# Altium project Power Driver.PrjPcb
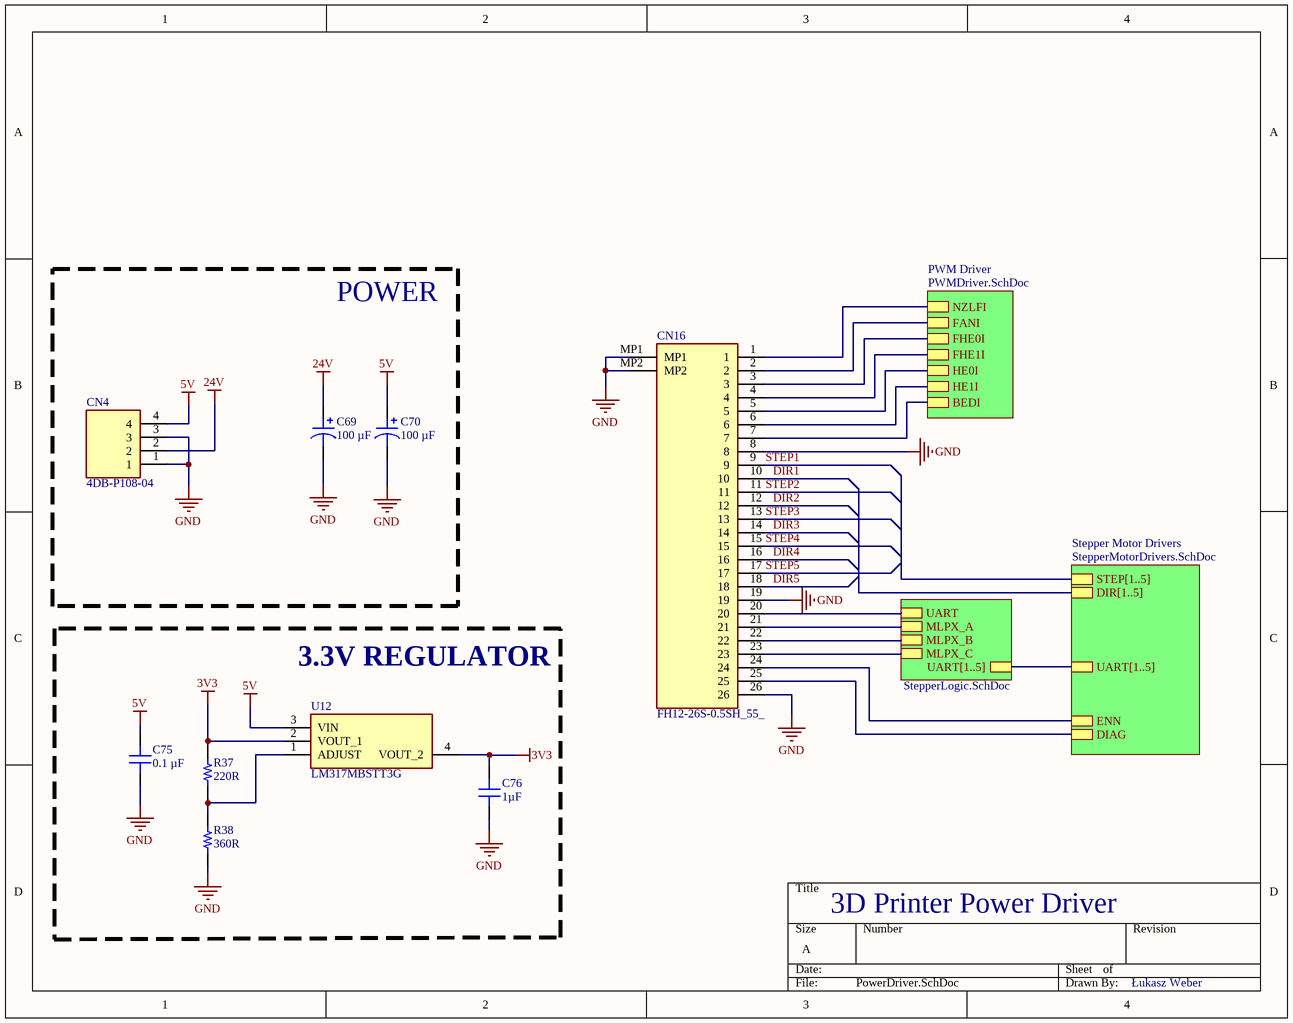
[diagram p0: PowerDriver.SchDoc]
4 sheets, 147 parts. Net scope: hierarchical (ports join the sheet entries above them; power ports are global).
Board file: PCB1.PcbDoc
Sheets:
  PowerDriver.SchDoc
    Stepper Motor Drivers = StepperMotorDrivers.SchDoc
    PWM Driver = PWMDriver.SchDoc
    Stepper Logic = StepperLogic.SchDoc

## Sheet PowerDriver.SchDoc: 3D Printer Power Driver
size A; Author: Łukasz Weber

### Parts
C69  100 µF  [CAP ALSMD 6.6MM H7.7MM]
C70  100 µF  [CAP ALSMD 6.6MM H7.7MM]
C75  0.1 µF  [CAP 0603_1608]
C76  1µF  [CAP 0603_1608]
CN4  4DB-P108-04  [SHDR4W132P0X826_1X4_3467X1270X1346P]
CN16  FH12-26S-0.5SH_55_  [FH1226S05SH55]
R37  220R  [RES 0603_1608]
R38  360R  [RES 0603_1608]
U12  LM317MBSTT3G  [SOT230P700X175-4N]

### Blocks framed on the sheet
POWER: C69 C70 CN4
3.3V REGULATOR: C75 C76 R37 R38 U12

### Sub-sheets
PWM Driver = PWMDriver.SchDoc: FHE1I, HE0I, BEDI, FANI, NZLFI, FHE0I, HE1I
Stepper Logic = StepperLogic.SchDoc: UART, MLPX_C, MLPX_A, MLPX_B, UART[1..5]
Stepper Motor Drivers = StepperMotorDrivers.SchDoc: STEP[1..5], DIAG, UART[1..5], DIR[1..5], ENN

### Nets
3V3: C76.2 R37.2 U12.2(VOUT_1) U12.4(VOUT_2)
5V: C70.1 C75.2 CN4.4 U12.3(VIN)
24V: C69.1 CN4.2
GND: C69.2 C70.2 C75.1 C76.1 CN4.1 CN4.3 CN16.8 CN16.19 CN16.26 CN16.MP1 CN16.MP2 R38.1
DIAG: CN16.25 ; sheet Stepper Motor Drivers/DIAG
DIR1: CN16.10
DIR2: CN16.12
DIR3: CN16.14
DIR4: CN16.16
DIR5: CN16.18
ENN: CN16.24 ; sheet Stepper Motor Drivers/ENN
MLPX_A: CN16.21 ; sheet Stepper Logic/MLPX_A
MLPX_B: CN16.22 ; sheet Stepper Logic/MLPX_B
MLPX_C: CN16.23 ; sheet Stepper Logic/MLPX_C
STEP1: CN16.9
STEP2: CN16.11
STEP3: CN16.13
STEP4: CN16.15
STEP5: CN16.17
UART: CN16.20 ; sheet Stepper Logic/UART
NetCN16_1: CN16.1 ; sheet PWM Driver/NZLFI
NetCN16_2: CN16.2 ; sheet PWM Driver/FANI
NetCN16_3: CN16.3 ; sheet PWM Driver/FHE0I
NetCN16_4: CN16.4 ; sheet PWM Driver/FHE1I
NetCN16_5: CN16.5 ; sheet PWM Driver/HE0I
NetCN16_6: CN16.6 ; sheet PWM Driver/HE1I
NetCN16_7: CN16.7 ; sheet PWM Driver/BEDI
NetR37_1: R37.1 R38.2 U12.1(ADJUST)

### Buses and harness runs
bus sheet Stepper Logic/UART[1..5] = sheet Stepper Motor Drivers/UART[1..5]

### Notes on the sheet
- 3D Printer Power Driver
- Łukasz Weber

### Library data of the parts
C69 C70 = UWT1E101MCL1GS: CAP ALUM 100UF 20% 25V SMD; manufacturer: Nichicon; Lifetime @ Temp.: 1000 Hrs @ 105°C; Polarization: Polar; Ripple Current @ High Frequency: 136.5 mA @ 10 kHz; Ripple Current @ Low Frequency: 91 mA @ 120 Hz; Surface Mount Land Size: 0.260" L x 0.260" W (6.60mm x 6.60mm); Part Number: UWT1E101MCL1GS; Applications: General Purpose; Capacitance: 100 µF; componentlink1description: Datasheet; componentlink1url: https://products.nichicon.co.jp/en/pdf/XJA043/e-uwt.pdf; componentlink2description: DigiKey Link; componentlink2url: https://www.digikey.com/en/products/detail/nichicon/UWT1E101MCL1GS/589931; Device Package: Radial, Can - SMD; Height - Seated (Max): 0.303" (7.70mm); lastupdated: 6/18/2023 8:45:36 PM; Lifecycle Status: Active; Minimum Order: 1; Mounting Type: Surface Mount; Operating Temperature: -55°C ~ 105°C; Package / Case: Radial, Can - SMD; packaging: TapeAndReel; partid: 27222; Part Status: Active; price: 0.10; series: UWT; Size / Dimension: 0.248" Dia (6.30mm); Supplier 1: DigiKey; Supplier Part Number 1: 493-2190-1-ND; Tolerance: ±20%; value: 100 µF; Voltage - Rated: 25 V
C75 = 0603B104K101CT: CAP CER 0.1UF 100V X7R 0603; manufacturer: Walsin Technology Corporation; Tolerance: ±10%; Part Number: 0603B104K101CT; Value: 0.1 µF; Applications: General Purpose; Capacitance: 0.1 µF; componentlink1description: Datasheet; componentlink1url: http://www.passivecomponent.com/wp-content/uploads/2018/10/MLCC.pdf; componentlink2description: DigiKey Link; componentlink2url: https://www.digikey.com/en/products/detail/walsin-technology-corporation/0603B104K101CT/9354889; Device Package: 0603 (1608 Metric); lastupdated: 4/8/2023 7:09:18 PM; Lifecycle Status: Active; Minimum Order: 1; Mounting Type: Surface Mount, MLCC; Operating Temperature: -55°C ~ 125°C; Package / Case: 0603 (1608 Metric); packaging: TapeAndReel; partid: 4273; Part Status: Active; price: 0.01; series: -; Size / Dimension: 0.063" L x 0.031" W (1.60mm x 0.80mm); Supplier 1: DigiKey; Supplier Part Number 1: 1292-1392-1-ND; Temperature Coefficient: X7R; Thickness (Max): 0.037" (0.95mm); Voltage - Rated: 100V
C76 = 0603YD105KAT4A: CAP CER 1UF 16V X5R 0603; manufacturer: AVX Corporation; Tolerance: ±10%; Part Number: 0603YD105KAT4A; Value: 1µF; Applications: General Purpose; Capacitance: 1µF; componentlink1description: Datasheet; componentlink1url: http://datasheets.avx.com/cx5r.pdf; componentlink2description: DigiKey Link; componentlink2url: http://digikey.com/product-detail/en/avx-corporation/0603YD105KAT4A/478-10365-1-ND/6797443; Device Package: 0603 (1608 Metric); lastupdated: 9/2/2020 1:03:10 AM; Lifecycle Status: Active; Minimum Order: 1; Mounting Type: Surface Mount, MLCC; Operating Temperature: -55°C ~ 85°C; Package / Case: 0603 (1608 Metric); packaging: TapeAndReel; partid: 15257; Part Status: Active; price: 0.03; series: -; Size / Dimension: 0.063" L x 0.032" W (1.60mm x 0.81mm); Supplier 1: DigiKey; Supplier Part Number 1: 478-10365-1-ND; Temperature Coefficient: X5R; Thickness (Max): 0.035" (0.90mm); Voltage - Rated: 16V
CN4 = 4DB-P108-04: Connector; Manufacturer_Name: TE Connectivity; Datasheet Link: https://www.te.com/commerce/DocumentDelivery/DDEController?Action=srchrtrv&DocNm=2-1437667-4&DocType=Customer+Drawing&DocLang=English; Height: 13.462mm; Manufacturer_Part_Number: 4DB-P108-04; Mouser Part Number: 571-214376676; Mouser Price/Stock: https://www.mouser.co.uk/ProductDetail/TE-Connectivity/4DB-P108-04?qs=JZD3Rbs9XzlqoR88q1UQbw%3D%3D; Arrow Part Number: 4DB-P108-04; Arrow Price/Stock: https://www.arrow.com/en/products/4db-p108-04/te-connectivity?region=nac
CN16 = FH12-26S-0.5SH_55_: Connector; Manufacturer_Name: Hirose; Manufacturer_Part_Number: FH12-26S-0.5SH(55); Datasheet Link: https://datasheet.datasheetarchive.com/originals/distributors/SFDatasheet-1/sf-00023459.pdf; Height: 2.2mm; Mouser Part Number: 798-FH12-26S-0.5SH55; Mouser Price/Stock: https://www.mouser.co.uk/ProductDetail/Hirose-Connector/FH12-26S-0.5SH55?qs=Ux3WWAnHpjC%2FipJJsmJDaQ%3D%3D; Arrow Part Number: FH12-26S-0.5SH(55); Arrow Price/Stock: https://www.arrow.com/en/products/fh12-26s-0.5sh-55/hirose-electric
R37 = RCS0603240RFKEA: RES SMD 240 OHM 1% 1/4W 0603; Manufacturer: Vishay Dale; Power (Watts): 0.25W, 1/4W; Resistance: 240 Ohms; Temperature Coefficient: ±100ppm/°C; Part Number: RCS0603240RFKEA; Value: 220R; ComponentLink1Description: Datasheet; ComponentLink1URL: https://www.vishay.com/docs/20065/rcse3.pdf; ComponentLink2Description: DigiKey Link; ComponentLink2URL: https://www.digikey.com/en/products/detail/vishay-dale/RCS0603240RFKEA/5868414; Composition: Thick Film; Device Package: 0603 (1608 Metric); Features: Automotive AEC-Q200, Pulse Withstanding; Height - Seated (Max): 0.020" (0.50mm); LastUpdated: 4/8/2023 7:29:03 PM; Lifecycle Status: Active; Minimum Order: 1; Number of Terminations: 2; Operating Temperature: -55°C ~ 155°C; Package / Case: 0603 (1608 Metric); Packaging: TapeAndReel; PartId: 62490; Part Status: Active; Price: 0.02; Ratings: AEC-Q200; Series: RCS e3; Size / Dimension: 0.061" L x 0.033" W (1.55mm x 0.85mm); Supplier 1: DigiKey; Supplier Part Number 1: 541-RCS0603240RFKEACT-ND; Supplier Device Package: 0603; Tolerance: ±1%
R38 = ESR03EZPJ202: RES SMD 2K OHM 5% 1/4W 0603; Manufacturer: Rohm Semiconductor; Power (Watts): 0.25W, 1/4W; Resistance: 2 kOhms; Temperature Coefficient: ±200ppm/°C; Part Number: ESR03EZPJ202; Value: 360R; ComponentLink1Description: Datasheet; ComponentLink1URL: https://www.rohm.com/datasheet/ESR01MZPF/esr-e; ComponentLink2Description: DigiKey Link; ComponentLink2URL: https://www.digikey.com/en/products/detail/rohm-semiconductor/ESR03EZPJ202/1762725; Composition: Thick Film; Device Package: 0603 (1608 Metric); Features: Automotive AEC-Q200, Pulse Withstanding; Height - Seated (Max): 0.022" (0.55mm); LastUpdated: 4/8/2023 7:30:16 PM; Lifecycle Status: Active; Minimum Order: 1; Number of Terminations: 2; Operating Temperature: -55°C ~ 155°C; Package / Case: 0603 (1608 Metric); Packaging: TapeAndReel; PartId: 16457; Part Status: Active; Price: 0.01; Ratings: AEC-Q200; Series: ESR; Size / Dimension: 0.063" L x 0.031" W (1.60mm x 0.80mm); Supplier 1: DigiKey; Supplier Part Number 1: RHM2.0KDCT-ND; Supplier Device Package: 0603; Tolerance: ±5%
U12 = LM317MBSTT3G: Integrated Circuit; Manufacturer_Name: onsemi; Datasheet Link: http://www.farnell.com/datasheets/2058184.pdf; Height: 1.75mm; Manufacturer_Part_Number: LM317MBSTT3G; Mouser Part Number: 863-LM317MBSTT3G; Mouser Price/Stock: https://www.mouser.co.uk/ProductDetail/onsemi/LM317MBSTT3G?qs=2OtswVQKCOFxsFzIc5DGlw%3D%3D; Arrow Part Number: LM317MBSTT3G; Arrow Price/Stock: https://www.arrow.com/en/products/lm317mbstt3g/on-semiconductor?region=nac

## Sheet StepperMotorDrivers.SchDoc
size C; SPICEModelCacheXNHKODXI: <root> / <DocumentId>XNHKODXI</DocumentId> / </root>
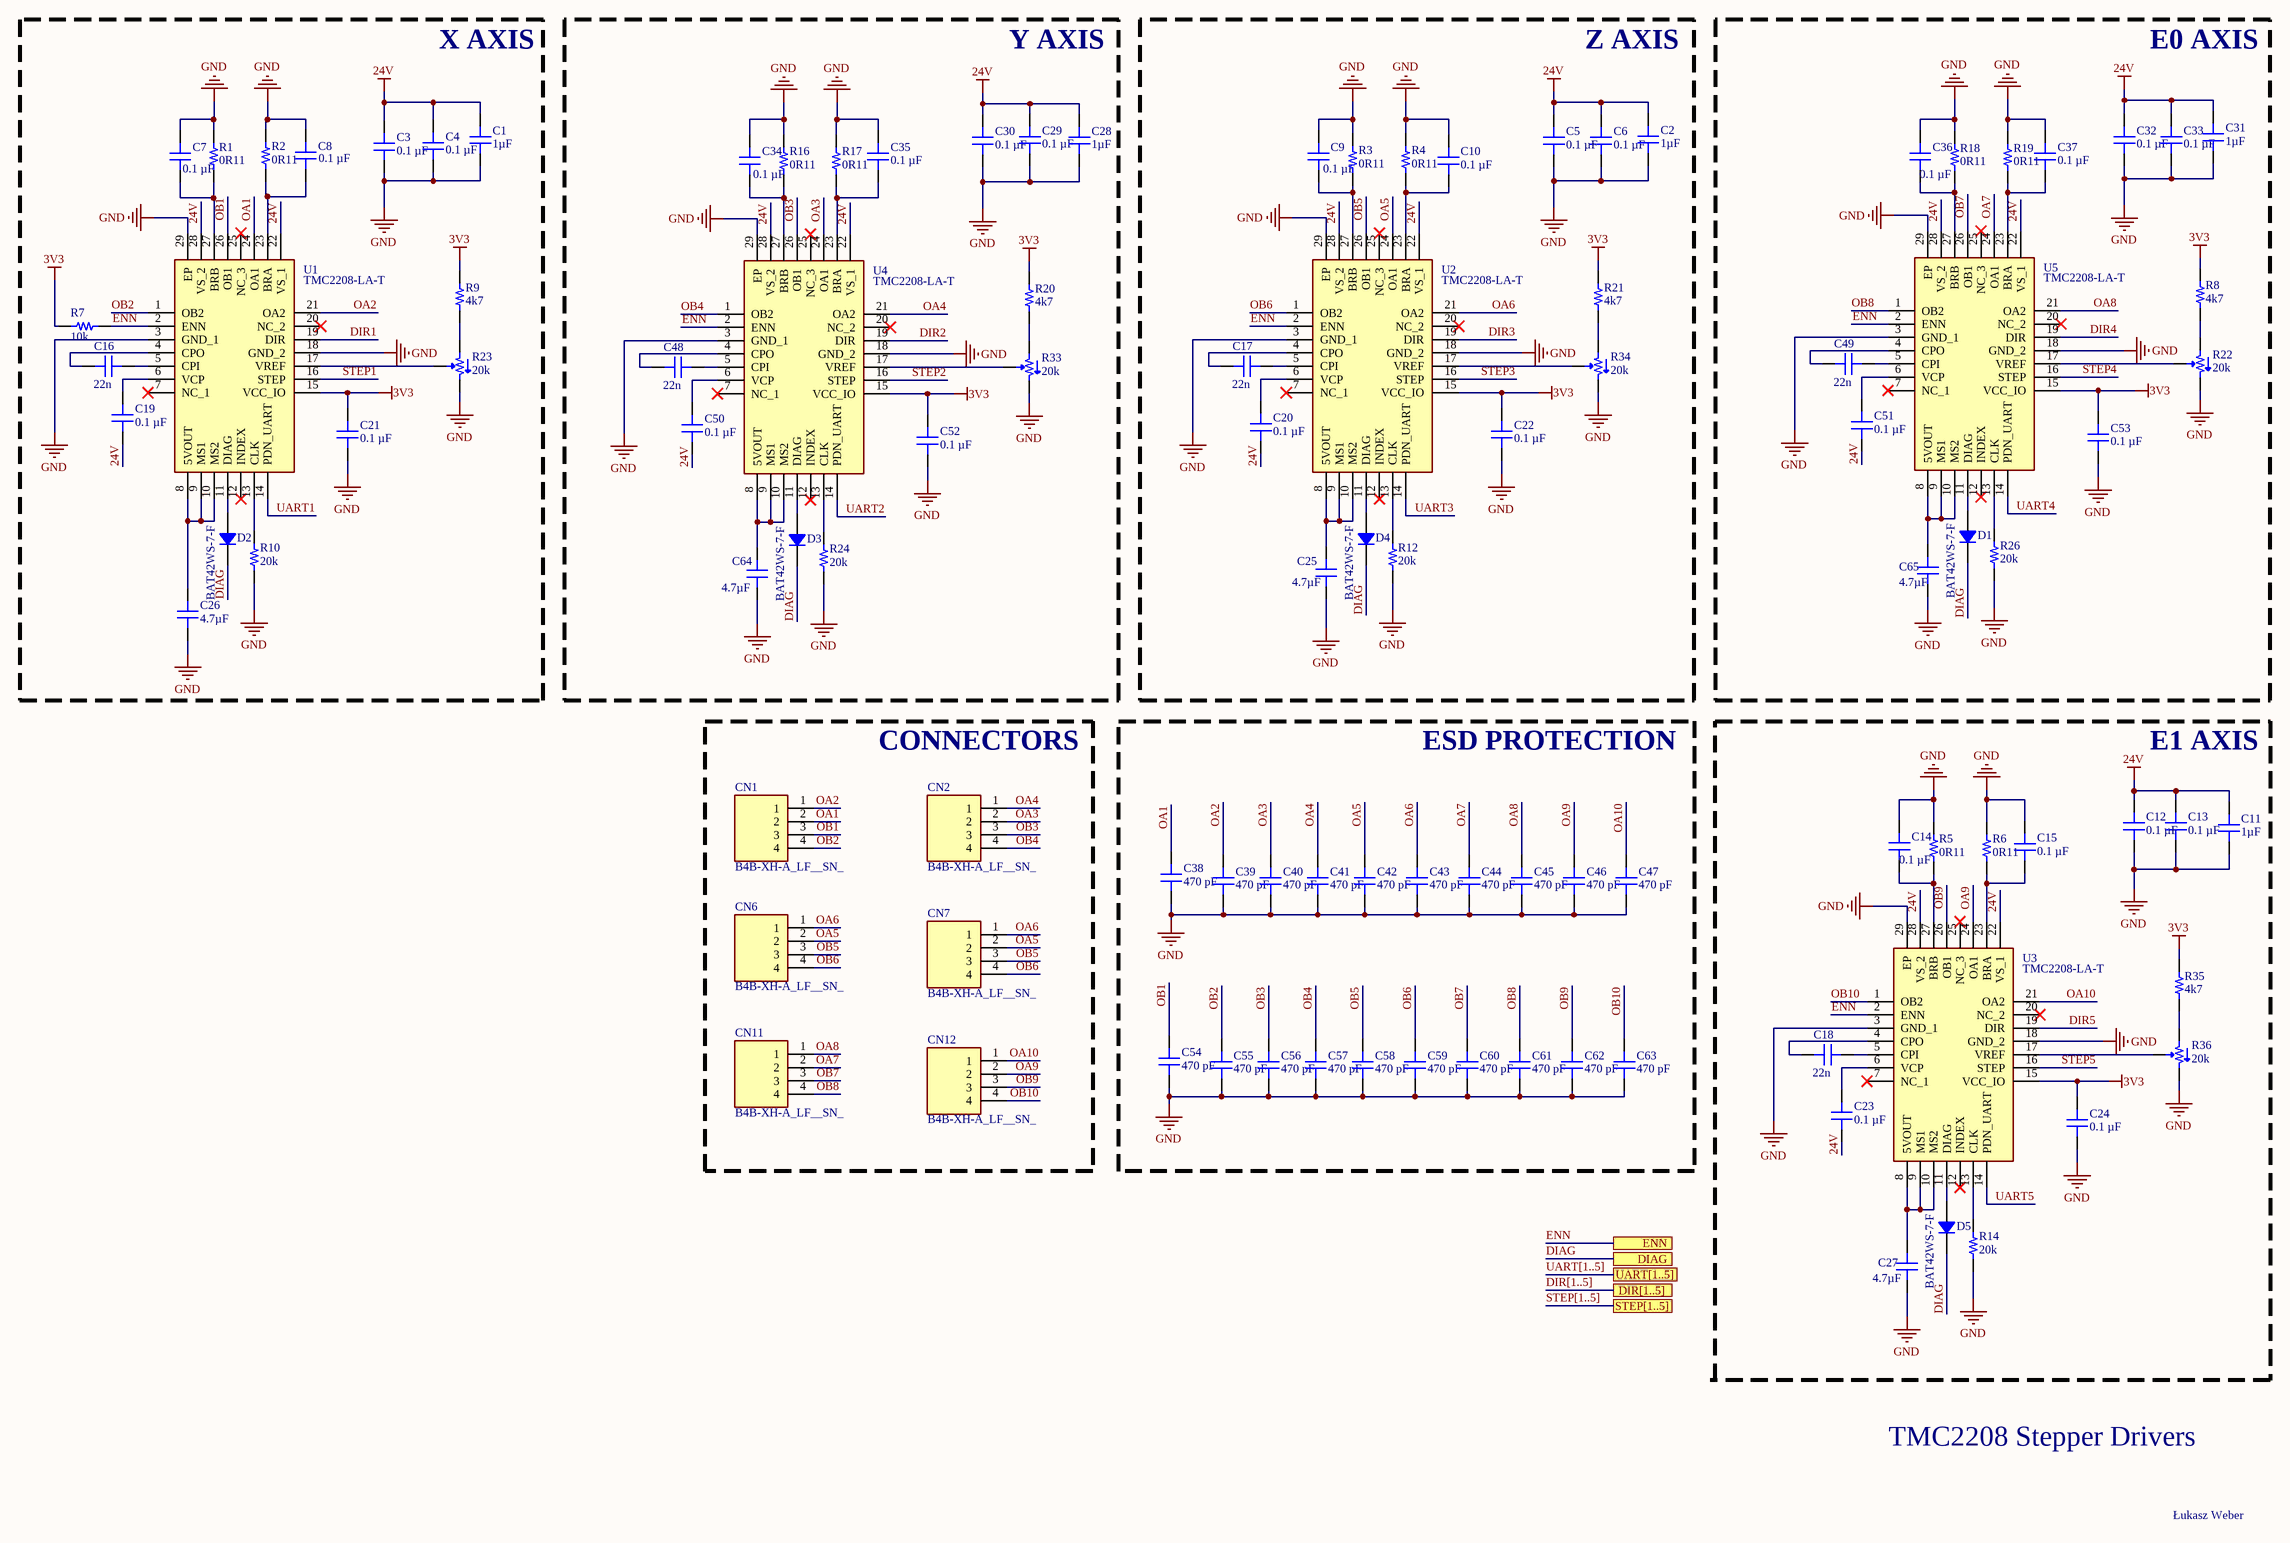
[diagram p1: StepperMotorDrivers.SchDoc]

### Parts
C1  1µF  [CAP 0603_1608]
C2  1µF  [CAP 0603_1608]
C3  0.1 µF  [CAP 0603_1608]
C4  0.1 µF  [CAP 0603_1608]
C5  0.1 µF  [CAP 0603_1608]
C6  0.1 µF  [CAP 0603_1608]
C7  0.1 µF  [CAP 0603_1608]
C8  0.1 µF  [CAP 0603_1608]
C9  0.1 µF  [CAP 0603_1608]
C10  0.1 µF  [CAP 0603_1608]
C11  1µF  [CAP 0603_1608]
C12  0.1 µF  [CAP 0603_1608]
C13  0.1 µF  [CAP 0603_1608]
C14  0.1 µF  [CAP 0603_1608]
C15  0.1 µF  [CAP 0603_1608]
C16  22n  [CAP 0603_1608]
C17  22n  [CAP 0603_1608]
C18  22n  [CAP 0603_1608]
C19  0.1 µF  [CAP 0603_1608]
C20  0.1 µF  [CAP 0603_1608]
C21  0.1 µF  [CAP 0603_1608]
C22  0.1 µF  [CAP 0603_1608]
C23  0.1 µF  [CAP 0603_1608]
C24  0.1 µF  [CAP 0603_1608]
C25  4.7µF  [CAP 0603_1608]
C26  4.7µF  [CAP 0603_1608]
C27  4.7µF  [CAP 0603_1608]
C28  1µF  [CAP 0603_1608]
C29  0.1 µF  [CAP 0603_1608]
C30  0.1 µF  [CAP 0603_1608]
C31  1µF  [CAP 0603_1608]
C32  0.1 µF  [CAP 0603_1608]
C33  0.1 µF  [CAP 0603_1608]
C34  0.1 µF  [CAP 0603_1608]
C35  0.1 µF  [CAP 0603_1608]
C36  0.1 µF  [CAP 0603_1608]
C37  0.1 µF  [CAP 0603_1608]
C38  470 pF  [CAP 0603_1608]
C39  470 pF  [CAP 0603_1608]
C40  470 pF  [CAP 0603_1608]
C41  470 pF  [CAP 0603_1608]
C42  470 pF  [CAP 0603_1608]
C43  470 pF  [CAP 0603_1608]
C44  470 pF  [CAP 0603_1608]
C45  470 pF  [CAP 0603_1608]
C46  470 pF  [CAP 0603_1608]
C47  470 pF  [CAP 0603_1608]
C48  22n  [CAP 0603_1608]
C49  22n  [CAP 0603_1608]
C50  0.1 µF  [CAP 0603_1608]
C51  0.1 µF  [CAP 0603_1608]
C52  0.1 µF  [CAP 0603_1608]
C53  0.1 µF  [CAP 0603_1608]
C54  470 pF  [CAP 0603_1608]
C55  470 pF  [CAP 0603_1608]
C56  470 pF  [CAP 0603_1608]
C57  470 pF  [CAP 0603_1608]
C58  470 pF  [CAP 0603_1608]
C59  470 pF  [CAP 0603_1608]
C60  470 pF  [CAP 0603_1608]
C61  470 pF  [CAP 0603_1608]
C62  470 pF  [CAP 0603_1608]
C63  470 pF  [CAP 0603_1608]
C64  4.7µF  [CAP 0603_1608]
C65  4.7µF  [CAP 0603_1608]
CN1  B4B-XH-A_LF__SN_  [B4BXHALFSN]
CN2  B4B-XH-A_LF__SN_  [B4BXHALFSN]
CN6  B4B-XH-A_LF__SN_  [B4BXHALFSN]
CN7  B4B-XH-A_LF__SN_  [B4BXHALFSN]
CN11  B4B-XH-A_LF__SN_  [B4BXHALFSN]
CN12  B4B-XH-A_LF__SN_  [B4BXHALFSN]
D1  BAT42WS-7-F  [SOD323]
D2  BAT42WS-7-F  [SOD323]
D3  BAT42WS-7-F  [SOD323]
D4  BAT42WS-7-F  [SOD323]
D5  BAT42WS-7-F  [SOD323]
R1  0R11  [RES 0805_2012]
R2  0R11  [RES 0805_2012]
R3  0R11  [RES 0805_2012]
R4  0R11  [RES 0805_2012]
R5  0R11  [RES 0805_2012]
R6  0R11  [RES 0805_2012]
R7  10k  [RES 0603_1608]
R8  4k7  [RES 0603_1608]
R9  4k7  [RES 0603_1608]
R10  20k  [RES 0603_1608]
R12  20k  [RES 0603_1608]
R14  20k  [RES 0603_1608]
R16  0R11  [RES 0805_2012]
R17  0R11  [RES 0805_2012]
R18  0R11  [RES 0805_2012]
R19  0R11  [RES 0805_2012]
R20  4k7  [RES 0603_1608]
R21  4k7  [RES 0603_1608]
R22  20k  [POT BOURNS TRIMPOT TC33]
R23  20k  [POT BOURNS TRIMPOT TC33]
R24  20k  [RES 0603_1608]
R26  20k  [RES 0603_1608]
R33  20k  [POT BOURNS TRIMPOT TC33]
R34  20k  [POT BOURNS TRIMPOT TC33]
R35  4k7  [RES 0603_1608]
R36  20k  [POT BOURNS TRIMPOT TC33]
U1  TMC2208-LA-T  [QFN50P500X500X90-29N-D]
U2  TMC2208-LA-T  [QFN50P500X500X90-29N-D]
U3  TMC2208-LA-T  [QFN50P500X500X90-29N-D]
U4  TMC2208-LA-T  [QFN50P500X500X90-29N-D]
U5  TMC2208-LA-T  [QFN50P500X500X90-29N-D]

### Blocks framed on the sheet
X AXIS: C1 C3 C4 C7 C8 C16 C19 C21 C26 D2 R1 R2 R7 R9 R10 R23 U1
Y AXIS: C28-C30 C34 C35 C48 C50 C52 C64 D3 R16 R17 R20 R24 R33 U4
Z AXIS: C2 C5 C6 C9 C10 C17 C20 C22 C25 D4 R3 R4 R12 R21 R34 U2
E0 AXIS: C31-C33 C36 C37 C49 C51 C53 C65 D1 R8 R18 R19 R22 R26 U5
CONNECTORS: CN1 CN2 CN6 CN7 CN11 CN12
ESD PROTECTION: C38-C47 C54-C63

### Ports
DIAG, DIR[1..5], ENN, STEP[1..5], UART[1..5]

### Nets
3V3: C21.2 C22.2 C24.2 C52.2 C53.2 R7.2 R8.1 R9.1 R20.1 R21.1 R35.1 U1.15(VCC_IO) U2.15(VCC_IO) U3.15(VCC_IO) U4.15(VCC_IO) U5.15(VCC_IO)
24V: C1.2 C2.2 C3.2 C4.2 C5.2 C6.2 C11.2 C12.2 C13.2 C19.1 C20.1 C23.1 C28.2 C29.2 C30.2 C31.2 C32.2 C33.2 C50.1 C51.1 U1.22(VS_1) U1.28(VS_2) U2.22(VS_1) U2.28(VS_2) U3.22(VS_1) U3.28(VS_2) U4.22(VS_1) U4.28(VS_2) U5.22(VS_1) U5.28(VS_2)
GND: C1.1 C2.1 C3.1 C4.1 C5.1 C6.1 C7.2 C8.2 C9.2 C10.2 C11.1 C12.1 C13.1 C14.2 C15.2 C21.1 C22.1 C24.1 C25.1 C26.1 C27.1 C28.1 C29.1 C30.1 C31.1 C32.1 C33.1 C34.2 C35.2 C36.2 C37.2 C38.1 C39.1 C40.1 C41.1 C42.1 C43.1 C44.1 C45.1 C46.1 C47.1 C52.1 C53.1 C54.1 C55.1 C56.1 C57.1 C58.1 C59.1 C60.1 C61.1 C62.1 C63.1 C64.1 C65.1 R1.2 R2.2 R3.2 R4.2 R5.2 R6.2 R10.1 R12.1 R14.1 R16.2 R17.2 R18.2 R19.2 R22.3 R23.3 R24.1 R26.1 R33.3 R34.3 R36.3 U1.3(GND_1) U1.18(GND_2) U1.29(EP) U2.3(GND_1) U2.18(GND_2) U2.29(EP) U3.3(GND_1) U3.18(GND_2) U3.29(EP) U4.3(GND_1) U4.18(GND_2) U4.29(EP) U5.3(GND_1) U5.18(GND_2) U5.29(EP)
DIAG: D1.2 D2.2 D3.2 D4.2 D5.2 ; port DIAG
DIR1: U1.19(DIR)
DIR2: U4.19(DIR)
DIR3: U2.19(DIR)
DIR4: U5.19(DIR)
DIR5: U3.19(DIR)
ENN: R7.1 U1.2(ENN) U2.2(ENN) U3.2(ENN) U4.2(ENN) U5.2(ENN) ; port ENN
OA1: C38.2 CN1.2 U1.24(OA1)
OA2: C39.2 CN1.1 U1.21(OA2)
OA3: C40.2 CN2.2 U4.24(OA1)
OA4: C41.2 CN2.1 U4.21(OA2)
OA5: C42.2 CN6.2 CN7.2 U2.24(OA1)
OA6: C43.2 CN6.1 CN7.1 U2.21(OA2)
OA7: C44.2 CN11.2 U5.24(OA1)
OA8: C45.2 CN11.1 U5.21(OA2)
OA9: C46.2 CN12.2 U3.24(OA1)
OA10: C47.2 CN12.1 U3.21(OA2)
OB1: C54.2 CN1.3 U1.26(OB1)
OB2: C55.2 CN1.4 U1.1(OB2)
OB3: C56.2 CN2.3 U4.26(OB1)
OB4: C57.2 CN2.4 U4.1(OB2)
OB5: C58.2 CN6.3 CN7.3 U2.26(OB1)
OB6: C59.2 CN6.4 CN7.4 U2.1(OB2)
OB7: C60.2 CN11.3 U5.26(OB1)
OB8: C61.2 CN11.4 U5.1(OB2)
OB9: C62.2 CN12.3 U3.26(OB1)
OB10: C63.2 CN12.4 U3.1(OB2)
STEP1: U1.16(STEP)
STEP2: U4.16(STEP)
STEP3: U2.16(STEP)
STEP4: U5.16(STEP)
STEP5: U3.16(STEP)
UART1: U1.14(PDN_UART)
UART2: U4.14(PDN_UART)
UART3: U2.14(PDN_UART)
UART4: U5.14(PDN_UART)
UART5: U3.14(PDN_UART)
NetC7_1: C7.1 R1.1 U1.27(BRB)
NetC8_1: C8.1 R2.1 U1.23(BRA)
NetC9_1: C9.1 R3.1 U2.27(BRB)
NetC10_1: C10.1 R4.1 U2.23(BRA)
NetC14_1: C14.1 R5.1 U3.27(BRB)
NetC15_1: C15.1 R6.1 U3.23(BRA)
NetC16_1: C16.1 U1.4(CPO)
NetC16_2: C16.2 U1.5(CPI)
NetC17_1: C17.1 U2.4(CPO)
NetC17_2: C17.2 U2.5(CPI)
NetC18_1: C18.1 U3.4(CPO)
NetC18_2: C18.2 U3.5(CPI)
NetC19_2: C19.2 U1.6(VCP)
NetC20_2: C20.2 U2.6(VCP)
NetC23_2: C23.2 U3.6(VCP)
NetC25_2: C25.2 U2.8(5VOUT) U2.9(MS1) U2.10(MS2)
NetC26_2: C26.2 U1.8(5VOUT) U1.9(MS1) U1.10(MS2)
NetC27_2: C27.2 U3.8(5VOUT) U3.9(MS1) U3.10(MS2)
NetC34_1: C34.1 R16.1 U4.27(BRB)
NetC35_1: C35.1 R17.1 U4.23(BRA)
NetC36_1: C36.1 R18.1 U5.27(BRB)
NetC37_1: C37.1 R19.1 U5.23(BRA)
NetC48_1: C48.1 U4.4(CPO)
NetC48_2: C48.2 U4.5(CPI)
NetC49_1: C49.1 U5.4(CPO)
NetC49_2: C49.2 U5.5(CPI)
NetC50_2: C50.2 U4.6(VCP)
NetC51_2: C51.2 U5.6(VCP)
NetC64_2: C64.2 U4.8(5VOUT) U4.9(MS1) U4.10(MS2)
NetC65_2: C65.2 U5.8(5VOUT) U5.9(MS1) U5.10(MS2)
NetD1_1: D1.1 U5.11(DIAG)
NetD2_1: D2.1 U1.11(DIAG)
NetD3_1: D3.1 U4.11(DIAG)
NetD4_1: D4.1 U2.11(DIAG)
NetD5_1: D5.1 U3.11(DIAG)
NetR8_2: R8.2 R22.1
NetR9_2: R9.2 R23.1
NetR10_2: R10.2 U1.13(CLK)
NetR12_2: R12.2 U2.13(CLK)
NetR14_2: R14.2 U3.13(CLK)
NetR20_2: R20.2 R33.1
NetR21_2: R21.2 R34.1
NetR22_2: R22.2 U5.17(VREF)
NetR23_2: R23.2 U1.17(VREF)
NetR24_2: R24.2 U4.13(CLK)
NetR26_2: R26.2 U5.13(CLK)
NetR33_2: R33.2 U4.17(VREF)
NetR34_2: R34.2 U2.17(VREF)
NetR35_2: R35.2 R36.1
NetR36_2: R36.2 U3.17(VREF)

Not connected (* = marked no-connect by the designer): U1 7(NC_1)* 12(INDEX)* 20(NC_2)* 25(NC_3)*; U2 7(NC_1)* 12(INDEX)* 20(NC_2)* 25(NC_3)*; U3 7(NC_1)* 12(INDEX)* 20(NC_2)* 25(NC_3)*; U4 7(NC_1)* 12(INDEX)* 20(NC_2)* 25(NC_3)*; U5 7(NC_1)* 12(INDEX)* 20(NC_2)* 25(NC_3)*

### Buses and harness runs
bus DIR[1..5] = port DIR[1..5]
bus STEP[1..5] = port STEP[1..5]
bus UART[1..5] = port UART[1..5]

### Notes on the sheet
- E1 AXIS
- TMC2208 Stepper Drivers
- Łukasz Weber

### Library data of the parts
C1 C2 C11 C28 C31 = 06035C105KAT2A: CAP CER 1UF 50V X7R 0603; manufacturer: AVX Corporation; Tolerance: ±10%; Part Number: 06035C105KAT2A; Value: 1µF; Applications: General Purpose; Capacitance: 1µF; componentlink1description: Datasheet; componentlink1url: http://datasheets.avx.com/X7RDielectric.pdf; componentlink2description: DigiKey Link; componentlink2url: http://digikey.com/product-detail/en/avx-corporation/06035C105KAT2A/478-10073-1-ND/6564295; Device Package: 0603 (1608 Metric); lastupdated: 9/2/2020 1:03:35 AM; Lifecycle Status: Active; Minimum Order: 1; Mounting Type: Surface Mount, MLCC; Operating Temperature: -55°C ~ 125°C; Package / Case: 0603 (1608 Metric); packaging: TapeAndReel; partid: 2905; Part Status: Active; price: 0.15; series: -; Size / Dimension: 0.063" L x 0.032" W (1.60mm x 0.81mm); Supplier 1: DigiKey; Supplier Part Number 1: 478-10073-1-ND; Temperature Coefficient: X7R; Thickness (Max): 0.020" (0.50mm); Voltage - Rated: 50V
C3-C10 C12-C15 C19-C24 C29 C30 C32-C37 C50-C53 = 0603B104K101CT: as C75 on sheet PowerDriver; Part Number: 0603B104K101CT; Value: 0.1 µF; Applications: General Purpose; Capacitance: 0.1 µF; componentlink1description: Datasheet; componentlink1url: http://www.passivecomponent.com/wp-content/uploads/2018/10/MLCC.pdf; componentlink2description: DigiKey Link; componentlink2url: https://www.digikey.com/en/products/detail/walsin-technology-corporation/0603B104K101CT/9354889; Device Package: 0603 (1608 Metric); lastupdated: 4/8/2023 7:09:18 PM; Lifecycle Status: Active; Minimum Order: 1; Mounting Type: Surface Mount, MLCC; Operating Temperature: -55°C ~ 125°C; Package / Case: 0603 (1608 Metric); packaging: TapeAndReel; partid: 4273; Part Status: Active; price: 0.01; series: -; Size / Dimension: 0.063" L x 0.031" W (1.60mm x 0.80mm); Supplier 1: DigiKey; Supplier Part Number 1: 1292-1392-1-ND; Temperature Coefficient: X7R; Thickness (Max): 0.037" (0.95mm); Voltage - Rated: 100V
C16-C18 C48 C49 = C0603C222G5GAC7867: CAP CER 2200PF 50V NP0 0603; manufacturer: KEMET; Temperature Coefficient: C0G, NP0; Tolerance: ±2%; Part Number: C0603C222G5GAC7867; Value: 22n; Applications: General Purpose; Capacitance: 2200 pF; componentlink1description: Datasheet; componentlink1url: https://api.kemet.com/component-edge/download/datasheet/C0603C222G5GACTU.pdf; componentlink2description: DigiKey Link; componentlink2url: https://www.digikey.com/en/products/detail/kemet/C0603C222G5GAC7867/2200244; Device Package: 0603 (1608 Metric); Features: Low ESL; lastupdated: 4/8/2023 7:08:51 PM; Lifecycle Status: Active; Minimum Order: 1; Mounting Type: Surface Mount, MLCC; Operating Temperature: -55°C ~ 125°C; Package / Case: 0603 (1608 Metric); packaging: TapeAndReel; partid: 12773; Part Status: Active; price: 0.18; series: SMD Comm C0G; Size / Dimension: 0.063" L x 0.031" W (1.60mm x 0.80mm); Supplier 1: DigiKey; Supplier Part Number 1: 399-14503-1-ND; Thickness (Max): 0.034" (0.87mm); Voltage - Rated: 50V
C25-C27 C64 C65 = 06036D475MAT2A: CAP CER 4.7UF 6.3V X5R 0603; manufacturer: AVX Corporation; Tolerance: ±20%; Part Number: 06036D475MAT2A; Value: 4.7µF; Applications: General Purpose; Capacitance: 4.7µF; componentlink1description: Datasheet; componentlink1url: http://datasheets.avx.com/cx5r.pdf; componentlink2description: DigiKey Link; componentlink2url: http://digikey.com/product-detail/en/avx-corporation/06036D475MAT2A/478-2582-1-ND/717527; Device Package: 0603 (1608 Metric); lastupdated: 9/2/2020 1:03:34 AM; Lifecycle Status: Active; Minimum Order: 1; Mounting Type: Surface Mount, MLCC; Operating Temperature: -55°C ~ 85°C; Package / Case: 0603 (1608 Metric); packaging: CutTape; partid: 2938; Part Status: Active; price: 0.81; series: -; Size / Dimension: 0.063" L x 0.032" W (1.60mm x 0.81mm); Supplier 1: DigiKey; Supplier Part Number 1: 478-2582-1-ND; Temperature Coefficient: X5R; Thickness (Max): 0.035" (0.90mm); Voltage - Rated: 6.3V
C38-C47 C54-C63 = C0603X471J5RAC7867: CAP CER 0603 470PF 5% X7R 50V FL; manufacturer: KEMET; Part Number: C0603X471J5RAC7867; Value: 470 pF; Applications: Boardflex Sensitive; Capacitance: 470 pF; componentlink1description: Datasheet; componentlink1url: https://api.kemet.com/component-edge/download/datasheet/C0603X471J5RAC7867.pdf; componentlink2description: DigiKey Link; componentlink2url: https://www.digikey.com/en/products/detail/kemet/C0603X471J5RAC7867/8572446; Device Package: 0603 (1608 Metric); Features: Soft Termination; lastupdated: 4/8/2023 7:09:16 PM; Lifecycle Status: Active; Minimum Order: 1; Mounting Type: Surface Mount, MLCC; Operating Temperature: -55°C ~ 125°C; Package / Case: 0603 (1608 Metric); packaging: TapeAndReel; partid: 4946; Part Status: Active; price: 0.09; series: SMD Comm X7R Flex; Size / Dimension: 0.063" L x 0.031" W (1.60mm x 0.80mm); Supplier 1: DigiKey; Supplier Part Number 1: 399-17611-1-ND; Temperature Coefficient: X7R; Thickness (Max): 0.037" (0.95mm); Tolerance: ±5%; Voltage - Rated: 50V
CN1 CN2 CN6 CN7 CN11 CN12 = B4B-XH-A_LF__SN_: Connector; Manufacturer_Name: JST (JAPAN SOLDERLESS TERMINALS); Manufacturer_Part_Number: B4B-XH-A(LF)(SN); Datasheet Link: https://datasheet.lcsc.com/szlcsc/JST-Sales-America-B4B-XH-A-LF-SN_C144395.pdf; Height: 7mm; Arrow Part Number: B4B-XH-A(LF)(SN); Arrow Price/Stock: https://www.arrow.com/en/products/b4b-xh-a-lf-sn/jst-manufacturing?region=europe
D1-D5 = BAT42WS-7-F: DIODE SCHOTTKY 30V 200MA SOD323; Manufacturer: Diodes Incorporated; Capacitance @ Vr, F: 10pF @ 1V, 1MHz; Current - Reverse Leakage @ Vr: 500 nA @ 25 V; Reverse Recovery Time (trr): 5 ns; Speed: Small Signal =< 200mA (Io), Any Speed; Voltage - Forward (Vf) (Max) @ If: 1 V @ 200 mA; Part Number: BAT42WS-7-F; ComponentLink1Description: Datasheet; ComponentLink1URL: https://www.diodes.com/assets/Datasheets/ds30100.pdf; ComponentLink2Description: DigiKey Link; ComponentLink2URL: https://www.digikey.com/en/products/detail/diodes-incorporated/BAT42WS-7-F/806536; Current - Average Rectified (Io): 200mA; Diode Type: Schottky; LastUpdated: 9/7/2023 8:41:08 PM; Lifecycle Status: Active; Minimum Order: 1; Mounting Type: Surface Mount; Operating Temperature - Junction: -55°C ~ 125°C; Package / Case: SC-76, SOD-323; Packaging: TapeAndReel; PartId: 3090; Part Status: Active; Price: 0.06; Series: -; Supplier 1: DigiKey; Supplier Part Number 1: BAT42WS-FDICT-ND; Supplier Device Package: SOD-323; Voltage - DC Reverse (Vr) (Max): 30 V
R1-R6 R16-R19 = ERJ-U6SFR15V: RES 0.15 OHM 1% 1/4W 0805; Manufacturer: Panasonic Electronic Components; Power (Watts): 0.25W, 1/4W; Resistance: 150 mOhms; Temperature Coefficient: ±150ppm/°C; Part Number: ERJ-U6SFR15V; Value: 0R11; ComponentLink1Description: Datasheet; ComponentLink1URL: https://industrial.panasonic.com/cdbs/www-data/pdf/RDP0000/AOA0000C334.pdf; ComponentLink2Description: DigiKey Link; ComponentLink2URL: https://www.digikey.com/en/products/detail/panasonic-electronic-components/ERJ-U6SFR15V/2811826; Composition: Thick Film; Device Package: 0805 (2012 Metric); Features: Anti-Sulfur, Automotive AEC-Q200; Height - Seated (Max): 0.026" (0.65mm); LastUpdated: 6/24/2023 8:04:48 PM; Lifecycle Status: Active; Minimum Order: 1; Number of Terminations: 2; Operating Temperature: -55°C ~ 155°C; Package / Case: 0805 (2012 Metric); Packaging: TapeAndReel; PartId: 27705; Part Status: Active; Price: 0.08; Ratings: AEC-Q200; Series: ERJ-U6S; Size / Dimension: 0.079" L x 0.049" W (2.00mm x 1.25mm); Supplier 1: DigiKey; Supplier Part Number 1: 10-ERJ-U6SFR15VCT-ND; Supplier Device Package: 0805; Tolerance: ±1%
R7-R10 R12 R14 R20 R21 R24 R26 R35 = ERJ-UP3F2002V: RES 20K OHM 1% 1/4W 0603; Manufacturer: Panasonic Electronic Components; Power (Watts): 0.25W, 1/4W; Resistance: 20 kOhms; Temperature Coefficient: ±100ppm/°C; Part Number: ERJ-UP3F2002V; ComponentLink1Description: Datasheet; ComponentLink1URL: https://b2b-api.panasonic.eu/file_stream/pids/fileversion/4484; ComponentLink2Description: DigiKey Link; ComponentLink2URL: https://www.digikey.com/en/products/detail/panasonic-electronic-components/ERJ-UP3F2002V/12092896; Composition: Thick Film; Device Package: 0603 (1608 Metric); Features: Anti-Sulfur, Automotive AEC-Q200, Pulse Withstanding; Height - Seated (Max): 0.022" (0.55mm); LastUpdated: 4/8/2023 7:29:07 PM; Lifecycle Status: Active; Minimum Order: 1; Number of Terminations: 2; Operating Temperature: -55°C ~ 155°C; Package / Case: 0603 (1608 Metric); Packaging: TapeAndReel; PartId: 63566; Part Status: Active; Price: 0.03; Ratings: AEC-Q200; Series: ERJ-UP3; Size / Dimension: 0.063" L x 0.031" W (1.60mm x 0.80mm); Supplier 1: DigiKey; Supplier Part Number 1: 10-ERJ-UP3F2002VCT-ND; Supplier Device Package: 0603; Tolerance: ±1%
  R7: Value: 10k
  R8 R9 R20 R21 R35: Value: 4k7
  R10 R12 R14 R24 R26: Value: 20k
R22 R23 R33 R34 R36 = TC33X-2-203E: TRIMMER 20K OHM 0.1W J LEAD TOP; Manufacturer: Bourns Inc.; Adjustment Type: Top Adjustment; Number of Turns: 1; Power (Watts): 0.1W, 1/10W; Resistance: 20 kOhms; Resistive Material: Cermet; Temperature Coefficient: ±250ppm/°C; Tolerance: ±25%; Value: 20 kOhms; Part Number: TC33X-2-203E; ComponentLink1Description: Datasheet; ComponentLink1URL: https://www.bourns.com/docs/Product-Datasheets/TC33.pdf; ComponentLink2Description: DigiKey Link; ComponentLink2URL: https://www.digikey.com/en/products/detail/bourns-inc/TC33X-2-203E/2566887; LastUpdated: 9/7/2023 8:25:30 PM; Lifecycle Status: Active; Minimum Order: 1; Mounting Type: Surface Mount; Packaging: TapeAndReel; PartId: 12; Part Status: Active; Price: 0.11; Series: Trimpot® TC33 - Open Frame; Size / Dimension: Rectangular - 0.150" x 0.142" Face (3.80mm x 3.60mm); Supplier 1: DigiKey; Supplier Part Number 1: TC33X-2-203ECT-ND; Termination Style: J Lead
U1-U5 = TMC2208-LA-T: Integrated Circuit; Manufacturer_Name: TRINAMIC; Datasheet Link: https://datasheet.datasheetarchive.com/originals/distributors/DKDS-23/450911.pdf; Height: 0.9mm; Manufacturer_Part_Number: TMC2208-LA-T; Mouser Part Number: 700-TMC2208-LA-T; Mouser Price/Stock: https://www.mouser.co.uk/ProductDetail/Trinamic/TMC2208-LA-T?qs=TiOZkKH1s2TUCbyrI5xF3A%3D%3D

## Sheet PWMDriver.SchDoc
size A4; SPICEModelCacheEKQLMBQO: <root> / <DocumentId>EKQLMBQO</DocumentId> / </root>
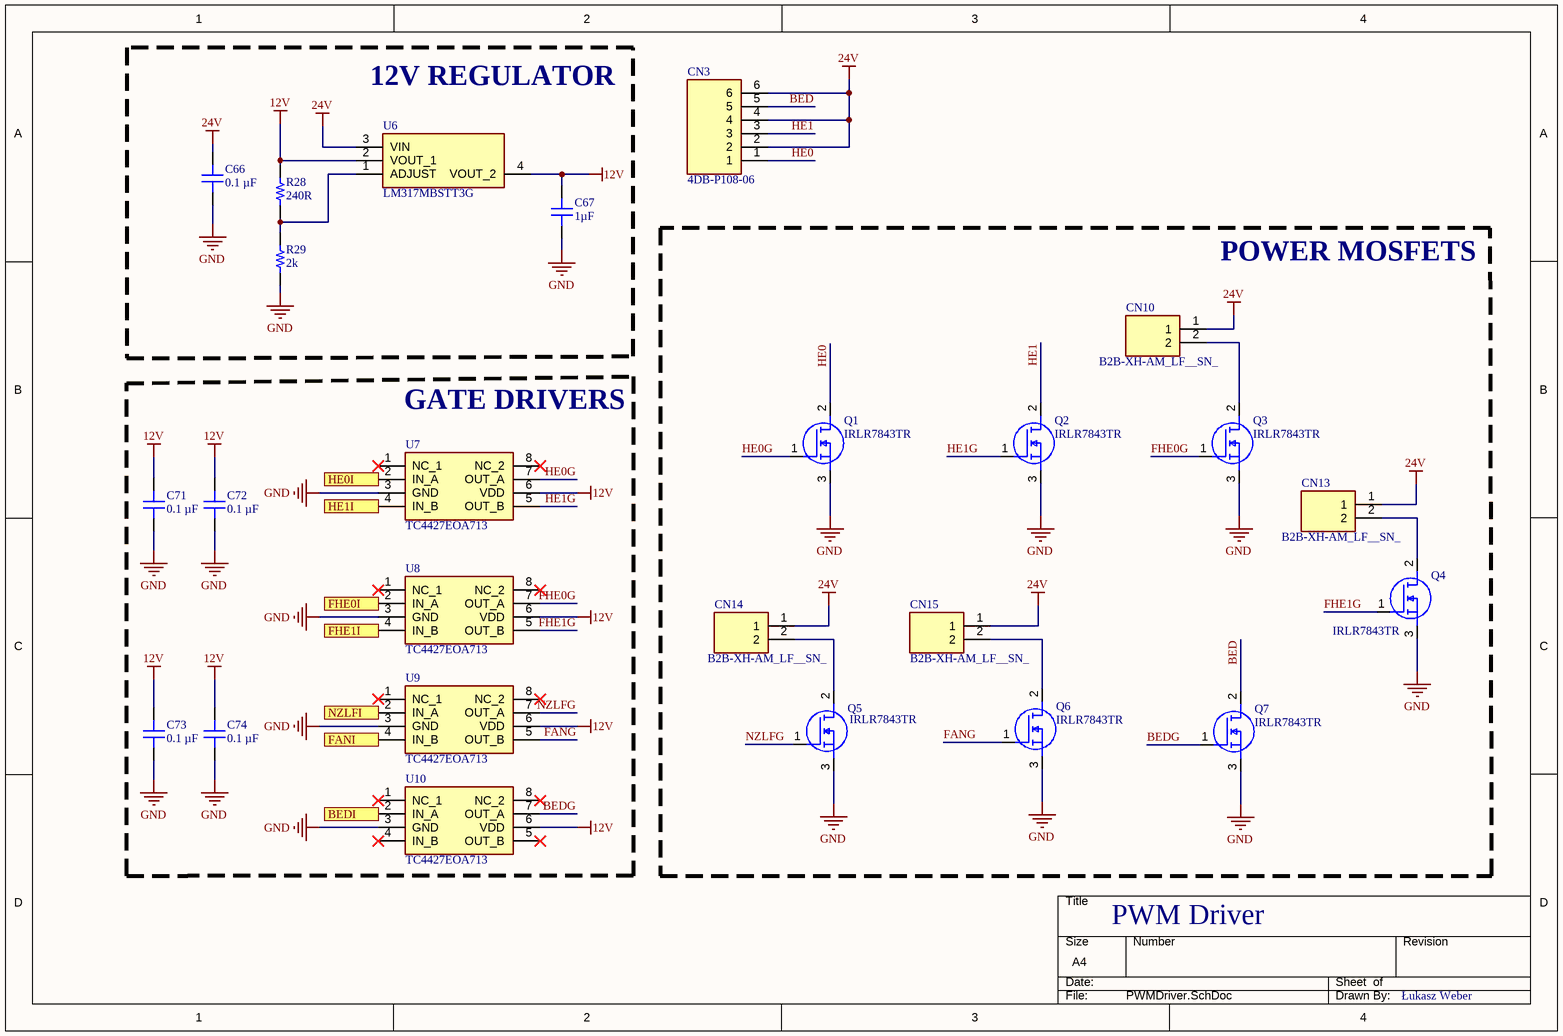
[diagram p2: PWMDriver.SchDoc]

### Parts
C66  0.1 µF  [CAP 0603_1608]
C67  1µF  [CAP 0603_1608]
C71  0.1 µF  [CAP 0603_1608]
C72  0.1 µF  [CAP 0603_1608]
C73  0.1 µF  [CAP 0603_1608]
C74  0.1 µF  [CAP 0603_1608]
CN3  4DB-P108-06  [4DBP10806]
CN10  B2B-XH-AM_LF__SN_  [B2BXHAMLFSN]
CN13  B2B-XH-AM_LF__SN_  [B2BXHAMLFSN]
CN14  B2B-XH-AM_LF__SN_  [B2BXHAMLFSN]
CN15  B2B-XH-AM_LF__SN_  [B2BXHAMLFSN]
Q1  IRLR7843TR  [IRLR7843TR]
Q2  IRLR7843TR  [IRLR7843TR]
Q3  IRLR7843TR  [IRLR7843TR]
Q4  IRLR7843TR  [IRLR7843TR]
Q5  IRLR7843TR  [IRLR7843TR]
Q6  IRLR7843TR  [IRLR7843TR]
Q7  IRLR7843TR  [IRLR7843TR]
R28  240R  [RES 0603_1608]
R29  2k  [RES 0603_1608]
U6  LM317MBSTT3G  [SOT230P700X175-4N]
U7  TC4427EOA713  [SOIC127P600X175-8N]
U8  TC4427EOA713  [SOIC127P600X175-8N]
U9  TC4427EOA713  [SOIC127P600X175-8N]
U10  TC4427EOA713  [SOIC127P600X175-8N]

### Blocks framed on the sheet
12V REGULATOR: C66 C67 R28 R29 U6
POWER MOSFETS: CN10 CN13-CN15 Q1-Q7
GATE DRIVERS: C71-C74 U7-U10

### Ports
BEDI, FANI, FHE0I, FHE1I, HE0I, HE1I, NZLFI

### Nets
12V: C67.2 C71.2 C72.2 C73.2 C74.2 R28.2 U6.2(VOUT_1) U6.4(VOUT_2) U7.6(VDD) U8.6(VDD) U9.6(VDD) U10.6(VDD)
24V: C66.2 CN3.2 CN3.4 CN3.6 CN10.1 CN13.1 CN14.1 CN15.1 U6.3(VIN)
GND: C66.1 C67.1 C71.1 C72.1 C73.1 C74.1 Q1.3(S) Q2.3(S) Q3.3(S) Q4.3(S) Q5.3(S) Q6.3(S) Q7.3(S) R29.1 U7.3(GND) U8.3(GND) U9.3(GND) U10.3(GND)
BED: CN3.5 Q7.2(D)
BEDG: Q7.1(G) U10.7(OUT_A)
FANG: Q6.1(G) U9.5(OUT_B)
FHE0G: Q3.1(G) U8.7(OUT_A)
FHE1G: Q4.1(G) U8.5(OUT_B)
HE0: CN3.1 Q1.2(D)
HE0G: Q1.1(G) U7.7(OUT_A)
HE1: CN3.3 Q2.2(D)
HE1G: Q2.1(G) U7.5(OUT_B)
NZLFG: Q5.1(G) U9.7(OUT_A)
NetCN10_2: CN10.2 Q3.2(D)
NetCN13_2: CN13.2 Q4.2(D)
NetCN14_2: CN14.2 Q5.2(D)
NetCN15_2: CN15.2 Q6.2(D)
NetCN16_1: U9.2(IN_A) ; port NZLFI
NetCN16_2: U9.4(IN_B) ; port FANI
NetCN16_3: U8.2(IN_A) ; port FHE0I
NetCN16_4: U8.4(IN_B) ; port FHE1I
NetCN16_5: U7.2(IN_A) ; port HE0I
NetCN16_6: U7.4(IN_B) ; port HE1I
NetCN16_7: U10.2(IN_A) ; port BEDI
NetR28_1: R28.1 R29.2 U6.1(ADJUST)

Not connected (* = marked no-connect by the designer): U7 1(NC_1)* 8(NC_2)*; U8 1(NC_1)* 8(NC_2)*; U9 1(NC_1)* 8(NC_2)*; U10 1(NC_1)* 4(IN_B)* 5(OUT_B)* 8(NC_2)*

### Notes on the sheet
- PWM Driver
- Łukasz Weber
- THIS DOCUMENT AND THE DATA DISCLOSED HEREIN OR
- HEREWITH IS THE PROPERTY OF ALTIUM LIMITED AND MAY
- DWG NO:
- REVISION
- REV:
- DESCRIPTION
- DATE
- APPROVED
- BE FREELY DISTRIBUTED IN WHOLE. NO RIGHTS ARE
- RESERVED OR EXPRESS OR IMPLIED WARANTEE GIVEN.
- ENG:
- APPROVALS
- PROJECT
- DSN:
- CHK:
- REFERENCE DOCUMENTS
- PROJECT REVISION:
- TITLE
- DOCUMENT REVISION:
- DESIGN ITEM:
- BOM:
- FAB DWG:
- PCB DWG:
- ASSY DWG:
- SCALE:
- A3
- SIZE
- CAGE CODE
- FILE NAME
- DWG NO.
- SHEET
- OF
- REV

### Library data of the parts
C66 C71-C74 = 0603B104K101CT: as C75 on sheet PowerDriver; Part Number: 0603B104K101CT; Value: 0.1 µF; Applications: General Purpose; Capacitance: 0.1 µF; componentlink1description: Datasheet; componentlink1url: http://www.passivecomponent.com/wp-content/uploads/2018/10/MLCC.pdf; componentlink2description: DigiKey Link; componentlink2url: https://www.digikey.com/en/products/detail/walsin-technology-corporation/0603B104K101CT/9354889; Device Package: 0603 (1608 Metric); lastupdated: 4/8/2023 7:09:18 PM; Lifecycle Status: Active; Minimum Order: 1; Mounting Type: Surface Mount, MLCC; Operating Temperature: -55°C ~ 125°C; Package / Case: 0603 (1608 Metric); packaging: TapeAndReel; partid: 4273; Part Status: Active; price: 0.01; series: -; Size / Dimension: 0.063" L x 0.031" W (1.60mm x 0.80mm); Supplier 1: DigiKey; Supplier Part Number 1: 1292-1392-1-ND; Temperature Coefficient: X7R; Thickness (Max): 0.037" (0.95mm); Voltage - Rated: 100V
C67 = 0603YD105KAT4A: as C76 on sheet PowerDriver; Part Number: 0603YD105KAT4A; Value: 1µF; Applications: General Purpose; Capacitance: 1µF; componentlink1description: Datasheet; componentlink1url: http://datasheets.avx.com/cx5r.pdf; componentlink2description: DigiKey Link; componentlink2url: http://digikey.com/product-detail/en/avx-corporation/0603YD105KAT4A/478-10365-1-ND/6797443; Device Package: 0603 (1608 Metric); lastupdated: 9/2/2020 1:03:10 AM; Lifecycle Status: Active; Minimum Order: 1; Mounting Type: Surface Mount, MLCC; Operating Temperature: -55°C ~ 85°C; Package / Case: 0603 (1608 Metric); packaging: TapeAndReel; partid: 15257; Part Status: Active; price: 0.03; series: -; Size / Dimension: 0.063" L x 0.032" W (1.60mm x 0.81mm); Supplier 1: DigiKey; Supplier Part Number 1: 478-10365-1-ND; Temperature Coefficient: X5R; Thickness (Max): 0.035" (0.90mm); Voltage - Rated: 16V
CN3 = 4DB-P108-06: Connector; Manufacturer_Name: TE Connectivity; Datasheet Link: https://www.te.com/commerce/DocumentDelivery/DDEController?Action=srchrtrv&DocNm=2-1437667-4&DocType=Customer+Drawing&DocLang=English; Height: 13.716mm; Manufacturer_Part_Number: 4DB-P108-06; Mouser Part Number: 571-214376679; Mouser Price/Stock: https://www.mouser.com/Search/Refine.aspx?Keyword=571-214376679
CN10 CN13-CN15 = B2B-XH-AM_LF__SN_: Connector; Manufacturer_Name: JST (JAPAN SOLDERLESS TERMINALS); Manufacturer_Part_Number: B2B-XH-AM(LF)(SN); Datasheet Link: https://www.jst-mfg.com/product/pdf/eng/eXH.pdf; Height: 7mm; Arrow Part Number: B2B-XH-AM(LF)(SN); Arrow Price/Stock: https://www.arrow.com/en/products/b2b-xh-am-lf-sn/jst-manufacturing?region=europe
Q1-Q7 = IRLR7843TR: MOSFET (N-Channel); Manufacturer_Name: Infineon; Datasheet Link: https://www.infineon.com/dgdl/irlr7843.pdf?fileId=5546d462533600a40153566ddfe226d6; Height: 2.52mm; Manufacturer_Part_Number: IRLR7843TR; Mouser Part Number: N/A; Mouser Price/Stock: https://www.mouser.co.uk/ProductDetail/Infineon-IR/IRLR7843TR?qs=Gkr2N%2F2q3o0Mj9Jsrst%252Bfw%3D%3D
R28 = RCS0603240RFKEA: as R37 on sheet PowerDriver; Part Number: RCS0603240RFKEA; Value: 240R; ComponentLink1Description: Datasheet; ComponentLink1URL: https://www.vishay.com/docs/20065/rcse3.pdf; ComponentLink2Description: DigiKey Link; ComponentLink2URL: https://www.digikey.com/en/products/detail/vishay-dale/RCS0603240RFKEA/5868414; Composition: Thick Film; Device Package: 0603 (1608 Metric); Features: Automotive AEC-Q200, Pulse Withstanding; Height - Seated (Max): 0.020" (0.50mm); LastUpdated: 4/8/2023 7:29:03 PM; Lifecycle Status: Active; Minimum Order: 1; Number of Terminations: 2; Operating Temperature: -55°C ~ 155°C; Package / Case: 0603 (1608 Metric); Packaging: TapeAndReel; PartId: 62490; Part Status: Active; Price: 0.02; Ratings: AEC-Q200; Series: RCS e3; Size / Dimension: 0.061" L x 0.033" W (1.55mm x 0.85mm); Supplier 1: DigiKey; Supplier Part Number 1: 541-RCS0603240RFKEACT-ND; Supplier Device Package: 0603; Tolerance: ±1%
R29 = ESR03EZPJ202: as R38 on sheet PowerDriver; Part Number: ESR03EZPJ202; Value: 2k; ComponentLink1Description: Datasheet; ComponentLink1URL: https://www.rohm.com/datasheet/ESR01MZPF/esr-e; ComponentLink2Description: DigiKey Link; ComponentLink2URL: https://www.digikey.com/en/products/detail/rohm-semiconductor/ESR03EZPJ202/1762725; Composition: Thick Film; Device Package: 0603 (1608 Metric); Features: Automotive AEC-Q200, Pulse Withstanding; Height - Seated (Max): 0.022" (0.55mm); LastUpdated: 4/8/2023 7:30:16 PM; Lifecycle Status: Active; Minimum Order: 1; Number of Terminations: 2; Operating Temperature: -55°C ~ 155°C; Package / Case: 0603 (1608 Metric); Packaging: TapeAndReel; PartId: 16457; Part Status: Active; Price: 0.01; Ratings: AEC-Q200; Series: ESR; Size / Dimension: 0.063" L x 0.031" W (1.60mm x 0.80mm); Supplier 1: DigiKey; Supplier Part Number 1: RHM2.0KDCT-ND; Supplier Device Package: 0603; Tolerance: ±5%
U6 = LM317MBSTT3G: as U12 on sheet PowerDriver; Datasheet Link: http://www.farnell.com/datasheets/2058184.pdf; Height: 1.75mm; Manufacturer_Part_Number: LM317MBSTT3G; Mouser Part Number: 863-LM317MBSTT3G; Mouser Price/Stock: https://www.mouser.co.uk/ProductDetail/onsemi/LM317MBSTT3G?qs=2OtswVQKCOFxsFzIc5DGlw%3D%3D; Arrow Part Number: LM317MBSTT3G; Arrow Price/Stock: https://www.arrow.com/en/products/lm317mbstt3g/on-semiconductor?region=nac
U7-U10 = TC4427EOA713: Integrated Circuit; Manufacturer_Name: Microchip; Datasheet Link: http://www.microchip.com/mymicrochip/filehandler.aspx?ddocname=en011741; Height: 1.75mm; Manufacturer_Part_Number: TC4427EOA713; Mouser Part Number: 579-TC4427EOA713; Mouser Price/Stock: https://www.mouser.co.uk/ProductDetail/Microchip-Technology/TC4427EOA713?qs=iwvYsH9bSFbKmD8r5x5IJg%3D%3D; Arrow Part Number: TC4427EOA713; Arrow Price/Stock: https://www.arrow.com/en/products/tc4427eoa713/microchip-technology

## Sheet StepperLogic.SchDoc
size A4
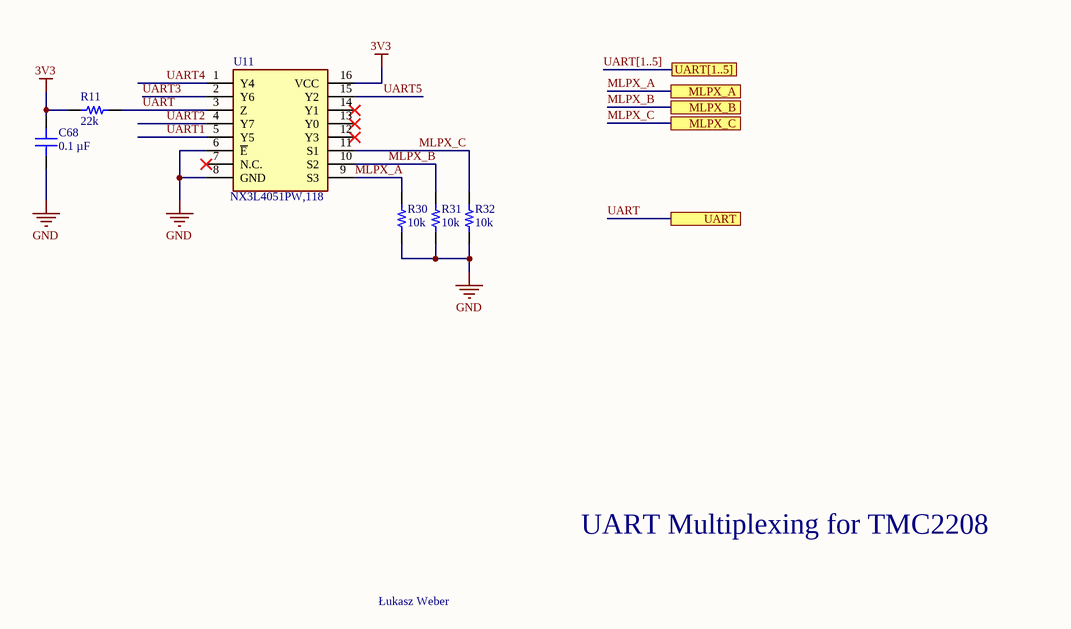
[diagram p3: StepperLogic.SchDoc]

### Parts
C68  0.1 µF  [CAP 0603_1608]
R11  22k  [RES 0603_1608]
R30  10k  [RES 0603_1608]
R31  10k  [RES 0603_1608]
R32  10k  [RES 0603_1608]
U11  NX3L4051PW,118  [SOP65P640X110-16N]

### Ports
MLPX_A, MLPX_B, MLPX_C, UART, UART[1..5]

### Nets
3V3: C68.2 R11.2 U11.16(VCC)
GND: C68.1 R30.2 R31.2 R32.2 U11.6(~{E}) U11.8(GND)
MLPX_A: R30.1 U11.9(S3) ; port MLPX_A
MLPX_B: R31.1 U11.10(S2) ; port MLPX_B
MLPX_C: R32.1 U11.11(S1) ; port MLPX_C
UART: R11.1 U11.3(Z) ; port UART
UART1: U11.5(Y5)
UART2: U11.4(Y7)
UART3: U11.2(Y6)
UART4: U11.1(Y4)
UART5: U11.15(Y2)

Not connected (* = marked no-connect by the designer): U11 7(N.C.)* 12(Y3)* 13(Y0)* 14(Y1)*

### Buses and harness runs
bus UART[1..5] = port UART[1..5]

### Notes on the sheet
- UART Multiplexing for TMC2208
- Łukasz Weber

### Library data of the parts
C68 = 0603B104K101CT: as C75 on sheet PowerDriver; Part Number: 0603B104K101CT; Value: 0.1 µF; Applications: General Purpose; Capacitance: 0.1 µF; componentlink1description: Datasheet; componentlink1url: http://www.passivecomponent.com/wp-content/uploads/2018/10/MLCC.pdf; componentlink2description: DigiKey Link; componentlink2url: https://www.digikey.com/en/products/detail/walsin-technology-corporation/0603B104K101CT/9354889; Device Package: 0603 (1608 Metric); lastupdated: 4/8/2023 7:09:18 PM; Lifecycle Status: Active; Minimum Order: 1; Mounting Type: Surface Mount, MLCC; Operating Temperature: -55°C ~ 125°C; Package / Case: 0603 (1608 Metric); packaging: TapeAndReel; partid: 4273; Part Status: Active; price: 0.01; series: -; Size / Dimension: 0.063" L x 0.031" W (1.60mm x 0.80mm); Supplier 1: DigiKey; Supplier Part Number 1: 1292-1392-1-ND; Temperature Coefficient: X7R; Thickness (Max): 0.037" (0.95mm); Voltage - Rated: 100V
R11 = ERJ-UP3F2002V: as R7 on sheet StepperMotorDrivers; Part Number: ERJ-UP3F2002V; Value: 22k; ComponentLink1Description: Datasheet; ComponentLink1URL: https://b2b-api.panasonic.eu/file_stream/pids/fileversion/4484; ComponentLink2Description: DigiKey Link; ComponentLink2URL: https://www.digikey.com/en/products/detail/panasonic-electronic-components/ERJ-UP3F2002V/12092896; Composition: Thick Film; Device Package: 0603 (1608 Metric); Features: Anti-Sulfur, Automotive AEC-Q200, Pulse Withstanding; Height - Seated (Max): 0.022" (0.55mm); LastUpdated: 4/8/2023 7:29:07 PM; Lifecycle Status: Active; Minimum Order: 1; Number of Terminations: 2; Operating Temperature: -55°C ~ 155°C; Package / Case: 0603 (1608 Metric); Packaging: TapeAndReel; PartId: 63566; Part Status: Active; Price: 0.03; Ratings: AEC-Q200; Series: ERJ-UP3; Size / Dimension: 0.063" L x 0.031" W (1.60mm x 0.80mm); Supplier 1: DigiKey; Supplier Part Number 1: 10-ERJ-UP3F2002VCT-ND; Supplier Device Package: 0603; Tolerance: ±1%
R30-R32 = RC0603FR-7W10KL: RES 10K OHM 1% 1/5W 0603; Manufacturer: Yageo; Power (Watts): 0.2W, 1/5W; Resistance: 10 kOhms; Temperature Coefficient: ±200ppm/°C; Part Number: RC0603FR-7W10KL; Value: 10k; ComponentLink1Description: Datasheet; ComponentLink1URL: https://www.yageo.com/upload/media/product/productsearch/datasheet/rchip/PYu-RC_Group_51_RoHS_L_11.pdf; ComponentLink2Description: DigiKey Link; ComponentLink2URL: https://www.digikey.com/en/products/detail/yageo/RC0603FR-7W10KL/12698809; Composition: Thick Film; Device Package: 0603 (1608 Metric); Features: Moisture Resistant; Height - Seated (Max): 0.022" (0.55mm); LastUpdated: 4/8/2023 7:28:57 PM; Lifecycle Status: Active; Minimum Order: 1; Number of Terminations: 2; Operating Temperature: -55°C ~ 155°C; Package / Case: 0603 (1608 Metric); Packaging: CutTape; PartId: 67088; Part Status: Active; Price: 0.01; Series: RC_L; Size / Dimension: 0.063" L x 0.031" W (1.60mm x 0.80mm); Supplier 1: DigiKey; Supplier Part Number 1: 13-RC0603FR-7W10KLCT-ND; Supplier Device Package: 0603; Tolerance: ±1%
U11 = NX3L4051PW,118: Integrated Circuit; Manufacturer_Name: NXP; Datasheet Link: http://www.nxp.com/docs/en/data-sheet/NX3L4051.pdf; Height: 1.1mm; Manufacturer_Part_Number: NX3L4051PW,118; Mouser Part Number: 771-NX3L4051PW118; Mouser Price/Stock: https://www.mouser.co.uk/ProductDetail/NXP-Semiconductors/NX3L4051PW118?qs=vbj%2FKoHZRAgFepmnkfH0Pw%3D%3D; Arrow Part Number: NX3L4051PW,118; Arrow Price/Stock: https://www.arrow.com/en/products/nx3l4051pw118/nxp-semiconductors?region=nac

## Nets that join several sheets
3V3: PowerDriver (C76.2 R37.2 U12.2 U12.4), StepperMotorDrivers (16 pins), StepperLogic (C68.2 R11.2 U11.16)
24V: PowerDriver (C69.1 CN4.2), StepperMotorDrivers (30 pins), PWMDriver (9 pins)
GND: PowerDriver (12 pins), StepperMotorDrivers (90 pins), PWMDriver (18 pins), StepperLogic (6 pins)
DIAG: PowerDriver (CN16.25), StepperMotorDrivers (5 pins)
ENN: PowerDriver (CN16.24), StepperMotorDrivers (6 pins)
MLPX_A: PowerDriver (CN16.21), StepperLogic (R30.1 U11.9)
MLPX_B: PowerDriver (CN16.22), StepperLogic (R31.1 U11.10)
MLPX_C: PowerDriver (CN16.23), StepperLogic (R32.1 U11.11)
NetCN16_1: PowerDriver (CN16.1), PWMDriver (U9.2)
NetCN16_2: PowerDriver (CN16.2), PWMDriver (U9.4)
NetCN16_3: PowerDriver (CN16.3), PWMDriver (U8.2)
NetCN16_4: PowerDriver (CN16.4), PWMDriver (U8.4)
NetCN16_5: PowerDriver (CN16.5), PWMDriver (U7.2)
NetCN16_6: PowerDriver (CN16.6), PWMDriver (U7.4)
NetCN16_7: PowerDriver (CN16.7), PWMDriver (U10.2)
UART: PowerDriver (CN16.20), StepperLogic (R11.1 U11.3)
UART1: StepperMotorDrivers (U1.14), StepperLogic (U11.5)
UART2: StepperMotorDrivers (U4.14), StepperLogic (U11.4)
UART3: StepperMotorDrivers (U2.14), StepperLogic (U11.2)
UART4: StepperMotorDrivers (U5.14), StepperLogic (U11.1)
UART5: StepperMotorDrivers (U3.14), StepperLogic (U11.15)